# EAGLE schematic OLM-periph-probe+ambient (EAGLE 6.4)
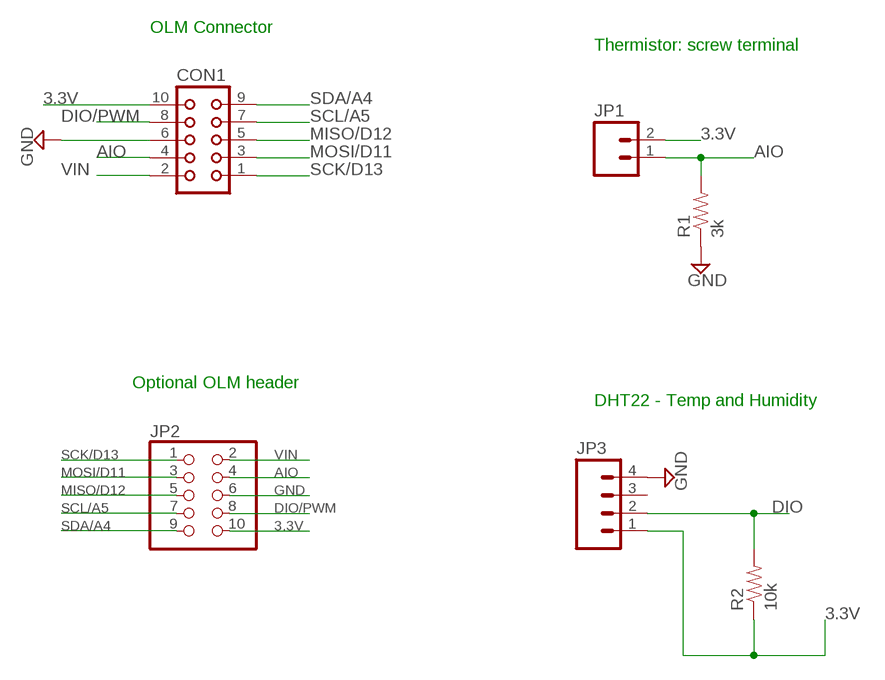
[diagram p0: schematic, sheet 1]

## Parts
CON1  CON10L  [CON10L]
JP1  M025MM  [SCREWTERMINAL-5MM-2]
JP2  PINHD-2X5  [2X05]
JP3  M04LOCK  [1X04_LOCK]
R1  3k  RESISTORPTH-1/4W  [AXIAL-0.4]
R2  10k  RESISTORPTH-1/4W  [AXIAL-0.4]

## Nets
3.3V [power]: CON1.10 JP1.2 JP2.10 JP3.1 R2.P$1
AIO: CON1.4 JP1.1 JP2.4 R1.P$2
DIO: JP3.2 R2.P$2
DIO/PWM: CON1.8 JP2.8
GND [power]: CON1.6 JP2.6 JP3.4 R1.P$1
MISO/D12: CON1.5 JP2.5
MOSI/D11: CON1.3 JP2.3
SCK/D13: CON1.1 JP2.1
SCL/A5: CON1.7 JP2.7
SDA/A4: CON1.9 JP2.9
VIN: CON1.2 JP2.2
Unconnected: JP3.3

## Notes on the sheet
- OLM Connector
- Thermistor: screw terminal
- Optional OLM header
- DHT22 - Temp and Humidity

## Library data of the parts
CON1 = con-harting:CON10L: CONNECTOR; OC_FARNELL: unknown; OC_NEWARK: unknown
JP1 = SparkFun-Connectors:M02: Header 2 Standard 2-pin 0.1" header. Use with straight break away headers (SKU : PRT-00116), right angle break away headers (PRT-00553), swiss pins (PRT-00743), machine pins (PRT-00117), and female headers (PRT-00115). Molex polarized connector foot print use with SKU : PRT-08233 with associated crimp pins and housings.
JP2 = pinhead:PINHD-2X5: PIN HEADER
JP3 = SparkFun-Connectors:M04: Header 4 Standard 4-pin 0.1" header. Use with straight break away headers (SKU : PRT-00116), right angle break away headers (PRT-00553), swiss pins (PRT-00743), machine pins (PRT-00117), and female headers (PRT-00115). Molex polarized connector foot print use with SKU : PRT-08231 with associated crimp pins and housings. 1MM SMD Version SKU: PRT-10208
R1 R2 = SparkFun-Passives:RESISTOR: Resistor Basic schematic elements and footprints for 0603, 1206, and PTH resistors.

## Net classes
0 default: width 0.254 mm, drill 0.254 mm, clearance 0.254 mm
1 power: width 0.813 mm, drill 0.254 mm, clearance 0.254 mm